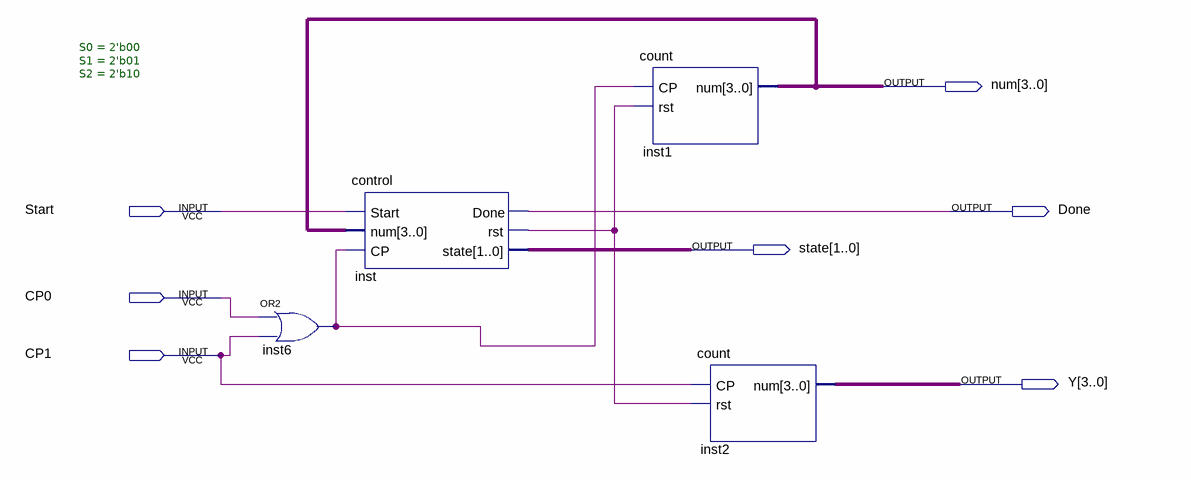
[diagram p0: schematic sheet]
// Quartus schematic demo.bdf as structural Verilog: 4 symbols, 7 pins
module demo (
  input  Start,
  input  CP0,
  input  CP1,
  output [3:0] num,
  output Done,
  output [1:0] state,
  output [3:0] Y
);

  wire inst6_out, inst_rst;

  or inst6 (inst6_out, CP0, CP1);
  control #(.S0(2'b00), .S1(2'b01), .S2(2'b10)) inst (
    .Start(Start), .num(num), .CP(inst6_out), .Done(Done), .rst(inst_rst), .state(state));
  count inst1 (.CP(inst6_out), .rst(inst_rst), .num(num));
  count inst2 (.CP(CP1), .rst(inst_rst), .num(Y));
endmodule
